# EAGLE design FTDI-Breakout_v21 (EAGLE 7.7.0)
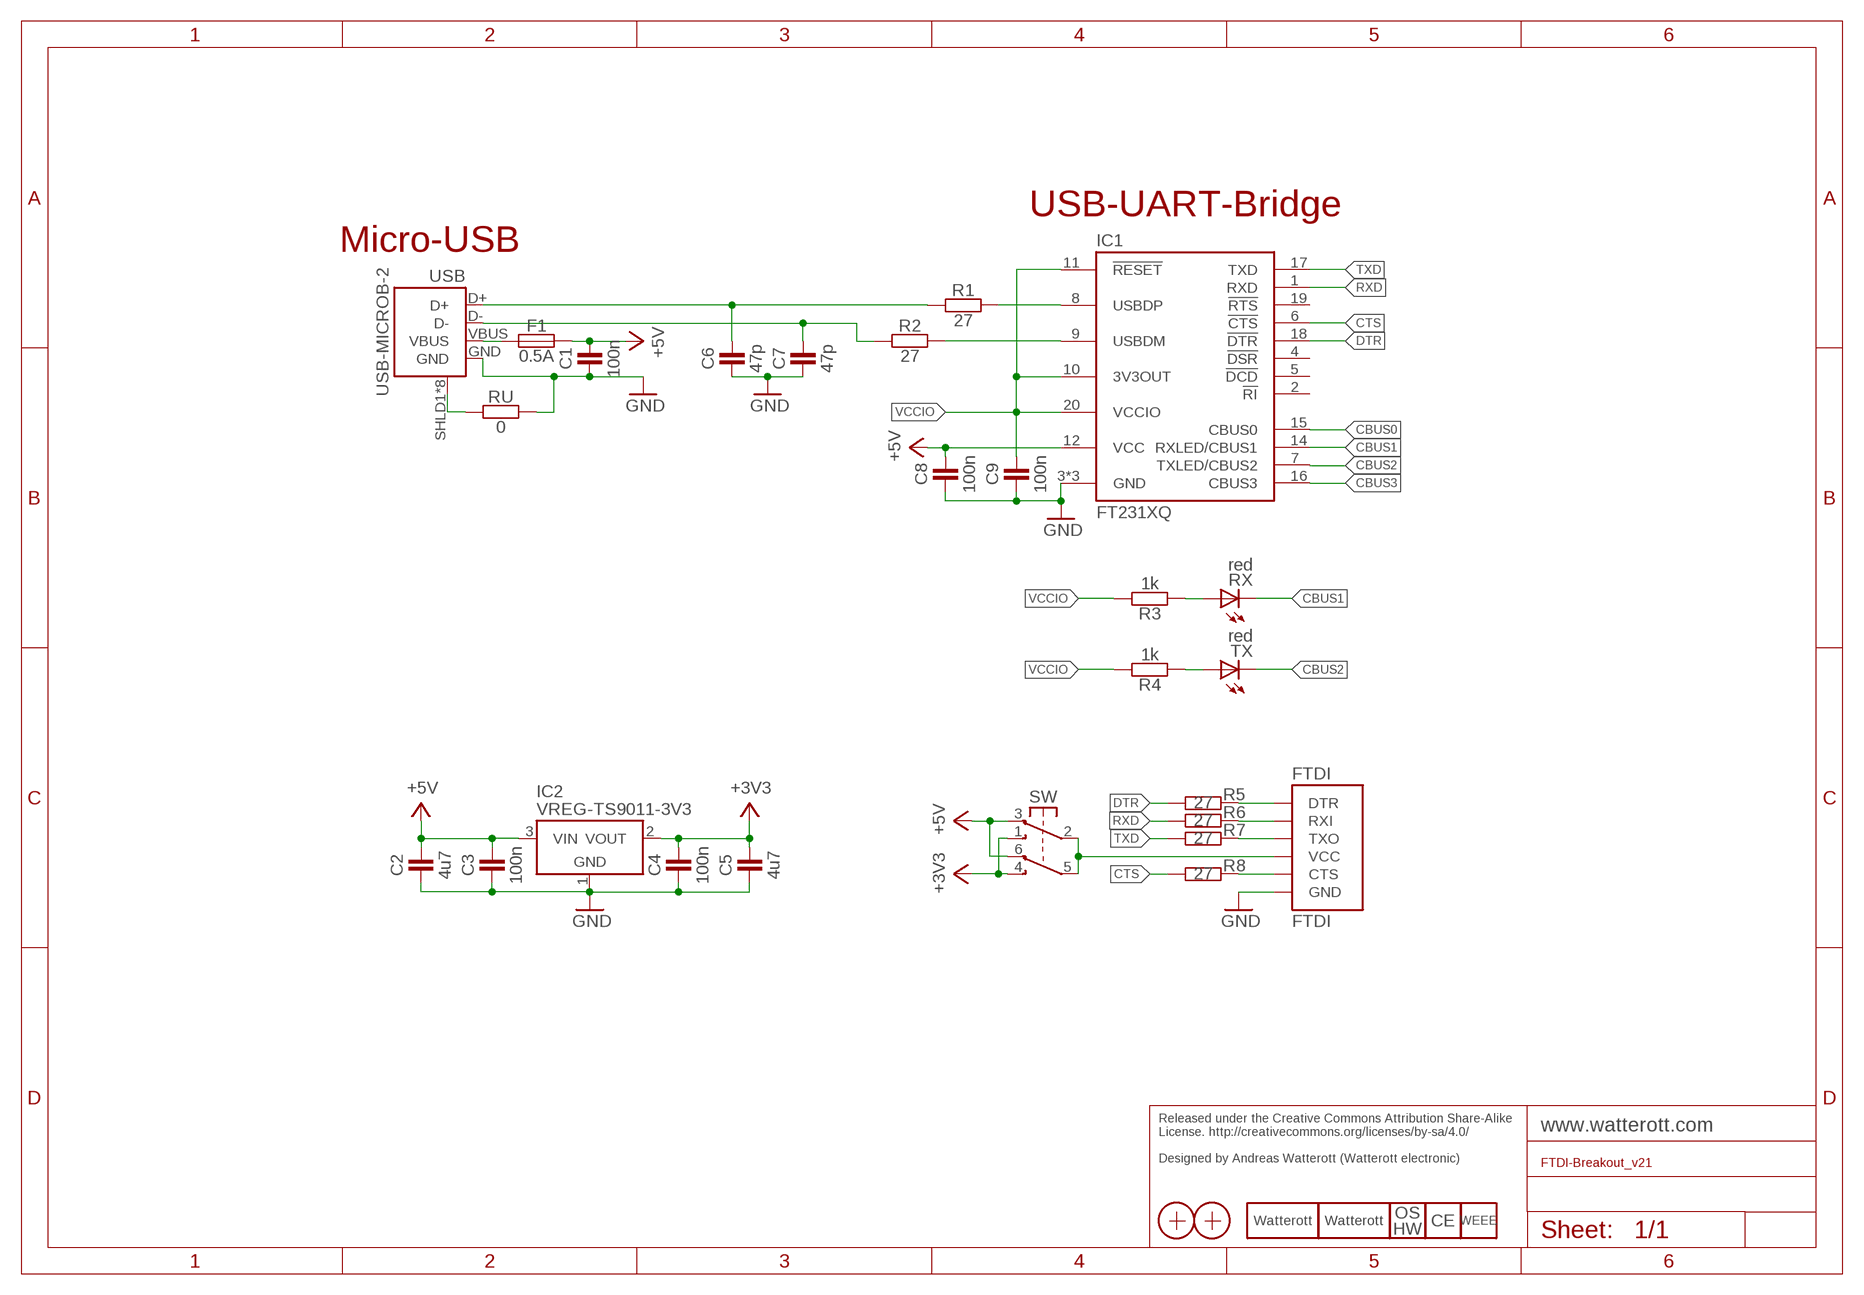
[diagram p0: schematic, sheet 1]

## Parts
C1  100n  CAPACITOR-0603  [C0603]
C2  4u7  CAPACITOR-0805  [C0805]
C3  100n  CAPACITOR-0603  [C0603]
C4  100n  CAPACITOR-0603  [C0603]
C5  4u7  CAPACITOR-0805  [C0805]
C6  47p  CAPACITOR-0603  [C0603]
C7  47p  CAPACITOR-0603  [C0603]
C8  100n  CAPACITOR-0603  [C0603]
C9  100n  CAPACITOR-0603  [C0603]
F1  0.5A  FUSE-0805  [C0805]
FTDI  FTDI  [FTDI]
IC1  FT231XQ  [QFN20-PAD]
IC2  VREG-TS9011-3V3  [SOT23]
LOGO5  LOGO_SPARK-2  [SPARK_2MM]
LOGO6  LOGO_SPARK-4  [SPARK_4MM]
LOGO7  LOGO_OSHW-2  [OSHW_2MM]
LOGO8  LOGO_CE-2  [CE_2MM]
LOGO9  LOGO_WEEE-4  [WEEE_4MM]
R1  27  RESISTOR-0603  [C0603]
R2  27  RESISTOR-0603  [C0603]
R3  1k  RESISTOR-0603  [C0603]
R4  1k  RESISTOR-0603  [C0603]
R5  27  RESISTOR-0603  [C0603]
R6  27  RESISTOR-0603  [C0603]
R7  27  RESISTOR-0603  [C0603]
R8  27  RESISTOR-0603  [C0603]
RU  0  RESISTOR-0603  [C0603]
RX  red  LED-0603  [C0603]
SW  SW-2UM-CUS22B  [CUS22B]
TX  red  LED-0603  [C0603]
USB  USB-MICROB-2  [USB-MICROB-10118194]
X1  PASSER-07  [PASSER_07MM]
X2  PASSER-07  [PASSER_07MM]

## Nets
+3V3: C4.2 C5.2 IC2.2(VOUT) SW.1(S1) SW.4(S2)
+5V: C1.2 C2.2 C3.2 C8.2 F1.2 IC1.12(VCC) IC2.3(VIN) SW.3(O1) SW.6(O2)
CBUS0: IC1.15(CBUS0)
CBUS1: IC1.14(RXLED/CBUS1) RX.C
CBUS2: IC1.7(TXLED/CBUS2) TX.C
CBUS3: IC1.16(CBUS3)
CTS: IC1.6(!CTS) R8.1
D2_N: IC1.9(USBDM) R2.2
D2_P: IC1.8(USBDP) R1.2
D_N: C7.2 R2.1 USB.D-
D_P: C6.2 R1.1 USB.D+
DTR: IC1.18(!DTR) R5.1
FTDI-CTS: FTDI.2-CTS(CTS) R8.2
FTDI-DTR: FTDI.6-DTR(DTR) R5.2
FTDI-RXI: FTDI.5-RXI(RXI) R6.2
FTDI-TXO: FTDI.4-TXO(TXO) R7.2
FTDI-VCC: FTDI.3-VCC(VCC) SW.2(P1) SW.5(P2)
GND: C1.1 C2.1 C3.1 C4.1 C5.1 C6.1 C7.1 C8.1 C9.1 FTDI.1-GND(GND) IC1.3(GND) IC1.13(GND) IC1.TP(GND) IC2.1(GND) RU.2 USB.GND
N$39: RU.1 USB.SHLD1(SHIELD) USB.SHLD2(SHIELD) USB.SHLD3(SHIELD) USB.SHLD4(SHIELD) USB.SHLD5(SHIELD) USB.SHLD6(SHIELD) USB.SHLD7(SHIELD) USB.SHLD8(SHIELD)
RX-LED: R3.1 RX.A
RXD: IC1.1(RXD) R6.1
TX-LED: R4.1 TX.A
TXD: IC1.17(TXD) R7.1
VBUS: F1.1 USB.VBUS
VCCIO: C9.2 IC1.10(3V3OUT) IC1.11(!RESET) IC1.20(VCCIO) R3.2 R4.2
Unconnected: IC1.2(!RI) IC1.4(!DSR) IC1.5(!DCD) IC1.19(!RTS)

## Notes on the sheet
- USB-UART-Bridge
- Micro-USB
- Released under the Creative Commons Attribution Share-Alike 
  License. http://creativecommons.org/licenses/by-sa/4.0/
  
  Designed by Andreas Watterott (Watterott electronic)

## Library data of the parts
C1-C9 = we-rcl:CAPACITOR: Capacitors ...2.2uF @ 6.3V -> 0402 ...4.7uF @ 6.3V -> 0603 ...10uF @ 16V -> 0805 ...22uF @ 25V -> 1206
F1 = we-rcl:FUSE: Fuses Polyfuses 0805 - 0.5A or 1A, 6V 1206 - 2A, 6V 1812 - 1A or 2A, 16V
FTDI = we-board:FTDI: FTDI 6pol connector
IC1 = we-chip:FT231X: FTDI FT231X USB to UART Bridge (5V tolerant inputs); DIGIKEY: 768-1128-6-ND
IC2 = we-power:VREG: Voltage Regulators (LDOs, Switching Converters...) LDOs Taiwan Semi TS1117 800mA max 15V - compatible On Semi NCP1117 1A max 20V - compatible Diodes AP2111H 0.6A max 6V (0.25V@0.6A) - compatible Diodes AP2114H 1A max 6V (0.45V@1A) Taiwan Semi TS9011 250mA max 12V - compatible Diodes AP2210 300mA max 15V - compatible Microchip MCP1700 250mA max 6.5V - compatible Microchip MCP1702 250mA max 13V - compatible Microchip MCP1703 250mA max 16V - compatible Microchip MCP1754 150mA max 16V Taiwan Semi TS5204 150mA max 16V (low noise) DC/DC Converter Modules Recom R-78Ex.x-1.0-W36 1A max 28V - compatible CUI V78xx-2000 2A max 18V Murata OKI-78SR-x.x/1.5-W36 1.5A max 36V
LOGO5 LOGO6 = we-symbol:LOGO_SPARK: Watterott electronic Logo
LOGO7 = we-symbol:LOGO_OSHW: Open-Source-Hardware Logo
LOGO8 = we-symbol:LOGO_CE: CE Logo
LOGO9 = we-symbol:LOGO_WEEE: WEEE Logo
R1-R8 RU = we-rcl:RESISTOR: Resistors all kinds in 0402 and 0603
RX TX = we-opto:LED: LEDs red, green, blue -> 0603
SW = we-switch:SW-2UM: Switch; DIGIKEY: 563-1105-6-ND
USB = we-con:USB: USB Connectors; DIGIKEY: 609-4618-6-ND
X1 X2 = we-symbol:PASSER: Fiducial Markers

## Board
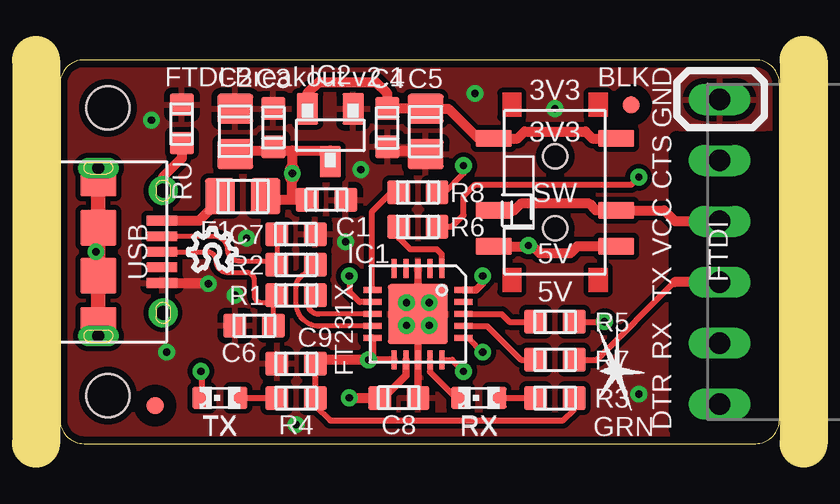
[diagram p1: board, top side]
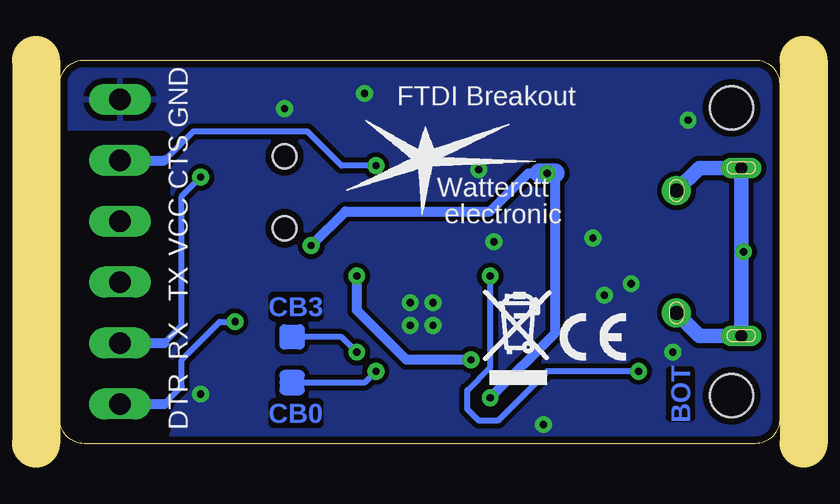
[diagram p2: board, bottom side, seen from below]

Size 30 x 16 mm. Coordinates in mm from the lower left corner, seen from the top.
Outline: 0,1 arc90 1,0 29,0 arc90 30,1 30,15 arc90 29,16 1,16 arc90 0,15 0,1
Copper layers (1*16): Top 0.035mm / dielectric 1.5mm / Bottom 0.035mm
Design rules "we-dru-2-layer *": minimum track width 0.15mm, minimum drill 0.3mm, track to track 0.15mm, track to pad 0.15mm, pad to pad 0.15mm, via to via 0.15mm, smd to smd 0.1mm, copper to edge 0.3mm, drill to drill 0.2mm, minimum pad ring 0.18mm, minimum via ring 0.2mm, stop-mask expansion 0.1mm, vias tented up to drill 0.5mm, thermal gap 0.25mm
Holes 1.8 mm at 2,2 2,14
tRestrict: area 25.7,0.6 to 29.5,12.7
bRestrict: area 25.7,0.6 to 29.5,12.7
Milling: 2 lines

### Footprints (pad centres in the part's own frame; a part is rotated, then mirrored left to right if it is on the bottom)
C0603 = smd 1 x 0.95: 1 0,0.8; 2 0,-0.8
C0805 = smd 1.5 x 1.25: 1 0,0.95; 2 0,-0.95
FTDI = drill 0.9 pad 1.3 long: 1-GND 0,6.35; 2-CTS 0,3.81; 3-VCC 0,1.27; 4-TXO 0,-1.27; 5-RXI 0,-3.81; 6-DTR 0,-6.35
QFN20-PAD = smd 0.8 x 0.26: 1 -1.9,1; 2 -1.9,0.5; 3 -1.9,0; 4 -1.9,-0.5; 5 -1.9,-1; 11 1.9,-1; 12 1.9,-0.5; 13 1.9,0; 14 1.9,0.5; 15 1.9,1 | smd 0.26 x 0.8: 6 -1,-1.9; 7 -0.5,-1.9; 8 0,-1.9; 9 0.5,-1.9; 10 1,-1.9; 16 1,1.9; 17 0.5,1.9; 18 0,1.9; 19 -0.5,1.9; 20 -1,1.9 | smd 2.5 x 2.5: TP 0,0
SOT23 = smd 1.3 x 0.9: 1 -1.1,0.95; 2 -1.1,-0.95; 3 1.1,0
C0603' = smd 0.9 x 0.8: A 0,-0.75; C 0,0.75
CUS22B = smd 0.7 x 1.5: 1 -2.25,2.55; 2 0.75,2.55; 3 2.25,2.55; 4 -2.25,-2.55; 5 0.75,-2.55; 6 2.25,-2.55 | hole 1: -1.5,0; 1.5,0
USB-MICROB-10118194 = smd 1.3 x 0.4: D+ -2.5,0; D- -2.5,-0.65; GND -2.5,1.3; ID -2.5,0.65; VBUS -2.5,-1.3 | drill 0.6 pad 1.2: SHLD1 -2.55,2.55; SHLD2 -2.55,-2.55 | drill 0.5 pad 0.8 long: SHLD3 0.15,3.5; SHLD4 0.15,-3.5 | smd 1.5 x 1.1: SHLD5 0.15,2.85; SHLD6 0.15,-2.85 | smd 1.5 x 1.5: SHLD7 0.15,1; SHLD8 0.15,-1
PASSER_07MM = smd 0.7 x 0.7: X 0,0

### Placement (x,y rotation side)
C1  11.11,10.16 270 top
C2  7.3,13.02 0 top
C3  8.89,13.18 0 top
C4  13.65,13.18 180 top
C5  15.24,13.02 180 top
C6  8.1,4.92 90 top
C7  9.84,8.73 270 top
C8  14.13,1.91 270 top
C9  9.84,3.33 90 top
F1  7.62,10.32 90 top
FTDI  27.5,8 0 top
IC1  14.92,5.4 270 top
IC2  11.27,12.86 270 top
LOGO5  23.18,3.02 90 top
LOGO6  14.76,11.91 0 bottom
LOGO7  6.35,8.1 0 top
LOGO8  7.78,4.45 0 bottom
LOGO9  10.95,4.45 0 bottom
R1  9.84,6.19 90 top
R2  9.84,7.46 90 top
R3  20.64,1.91 90 top
R4  9.84,1.91 90 top
R5  20.64,5.08 90 top
R6  14.92,9.05 90 top
R7  20.64,3.49 90 top
R8  14.92,10.48 90 top
RU  5.08,13.34 180 top
RX  red  [C0603']  17.46,1.91 90 top
SW  20.64,10.48 270 top
TX  red  [C0603']  6.67,1.91 90 top
USB  1.75,8 180 top
X1  3.97,1.59 0 top
X2  23.81,14.13 0 top

### Tracks (layer width: path | path; a pad name or v marks a point on that pad's centre or on a via)
+3V3
  Top 0.254: 18.06,12.7 SW.4
  Top 0.406: SW.4 19.08,12.73 19.37,13.02 21.91,13.02 22.2,12.73 SW.1 | 18.06,12.7 17.46,12.7 16.2,13.97 C5.2 13.65,13.97 C4.2 13.65,14.61 13.18,15.08 10.79,15.08 10.32,14.61 IC2.2
+5V  (via drill 0.3)
  Top 0.254: 8.89,12.07 8.89,12.06 8.89,12.22
  Top 0.305: IC1.12 14.42,2.83 13.49,1.91 C8.2
  Top 0.406: v12.06,1.91 C8.2 | SW.3 21.56,8.23 21.27,7.94 20,7.94 19.71,8.23 19.53,8.23 | C2.2 7.3,12.22 8.89,12.22 | C1.2 9.68,10.16 | 9.68,10.16 9.68,11.11 | 8.89,12.22 9.68,12.22 | 9.68,12.22 9.68,11.43 | 9.68,10.16 8.73,10.16 F1.2 | SW.6 19.53,8.23 | v19.53,8.26 19.53,8.23 | 9.68,12.22 11.27,12.22 IC2.3 | 8.89,12.22 C3.2
  Top 0.61: 9.68,11.11 v9.68,11.27 9.68,11.43
  Top 0.813: C2.2 7.3,11.91
  Bottom 0.406: 10,11.27 10.48,11.27 12.06,9.68 18.1,9.68 v19.53,8.26 | 9.37,11.27 9.37,4.6 v12.06,1.91
  Bottom 0.813: 9.37,11.27 v9.68,11.27 10,11.27
CBUS0  (via drill 0.3)
  Top 0.254: IC1.15 16.35,3.5 v16.83,3.02
  Bottom 0.254: v16.83,3.02 17.3,2.54 20,2.54
  Bottom 0.406: 20.64,2.54 20.64,2.86 20,2.86 20,2.54 | 20.64,2.54 20.64,2.22 20,2.22 20,2.54 | 20,2.54 20.64,2.54
CBUS1
  Top 0.254: IC1.14 15.42,2.99 16.51,1.91 RX.C
CBUS2  (via drill 0.3)
  Top 0.254: IC1.7 12.5,5.9 12.06,6.33 v12.06,6.99 | TX.C 5.92,2.97 v5.87,3.02
  Bottom 0.254: v12.06,6.99 12.06,3.17 13.02,2.22 13.02,1.43 12.54,0.95 11.75,0.95 9.68,3.02 v5.87,3.02
CBUS3  (via drill 0.3)
  Top 0.254: IC1.16 17.03,4.4 v17.62,3.81
  Bottom 0.254: v17.62,3.81 18.26,4.45 20.64,4.45
  Bottom 0.406: 20,4.76 20,4.13 20.64,4.13 20.64,4.45 20.64,4.76 20,4.76
CTS
  Top 0.254: IC1.6 13.02,6.5 13.02,6.51 13.02,9.68 13.81,10.48 R8.1
D2_N
  Top 0.203: IC1.9 10.82,4.9 arc-90 9.84,5.87 9.84,6.51 arc-90 10.48,7.14 10.69,7.36 10.69,7.41 R2.2
D2_P
  Top 0.203: IC1.8 10.79,5.4 arc-90 10.32,5.87 10.32,6.19 R1.2
D_N
  Top 0.15: 8.86,7.59 8.91,7.59
  Top 0.203: USB.D- 6.43,8.65 arc-90 6.99,8.1 arc90 7.46,7.62 8.83,7.62 8.86,7.59 | C7.2 R2.1 8.91,7.59
D_P
  Top 0.15: 8.9,5.88 8.89,5.87
  Top 0.203: USB.D+ 6.13,8 arc-90 6.51,7.62 arc90 6.99,7.14 7.78,7.14 arc-90 8.1,6.83 8.1,6.19 arc90 8.41,5.87 8.89,5.87 8.95,5.82 | C6.2 8.9,5.88 8.9,6.04 R1.1
DTR
  Top 0.254: IC1.18 18.41,5.4 18.73,5.08 R5.1
FTDI-CTS  (via drill 0.3)
  Top 0.254: R8.2 16.03,10.48 16.83,11.27 v16.83,11.59
  Bottom 0.254: v16.83,11.59 18.26,11.59 19.68,13.02 24.45,13.02 25.66,11.81
  Bottom 0.406: FTDI.2-CTS 25.66,11.81
FTDI-DTR  (via drill 0.3)
  Top 0.254: R5.2 v22.7,5.08
  Bottom 0.254: 25.66,1.65 24.92,2.38 24.92,3.49 23.34,5.08 v22.7,5.08
  Bottom 0.406: FTDI.6-DTR 25.66,1.65
FTDI-RXI  (via drill 0.3)
  Top 0.254: R6.2 16.35,9.05 16.83,9.53 16.83,10.32 17.3,10.79 23.81,10.79 v24.13,11.11
  Bottom 0.254: 25.66,4.19 24.92,4.92 24.92,10.32 v24.13,11.11
  Bottom 0.406: FTDI.5-RXI 25.66,4.19
FTDI-TXO
  Top 0.254: R7.2 22.38,3.49 25.62,6.73
  Top 0.406: FTDI.4-TXO 25.62,6.73
FTDI-VCC
  Top 0.406: SW.5 18.93,9.73 19.21,10 22.07,10 22.34,9.73 SW.2 25.2,9.73 25.66,9.27 FTDI.3-VCC
GND  (via drill 0.3)
  Top 0.254: 14.92,4.92 IC1.TP | v14.45,4.92 14.92,4.92 | v15.4,4.92 14.92,4.92 | v14.45,5.87 14.92,5.87 v15.4,5.87
  Top 0.305: IC1.13 14.92,4.92 | IC1.3 14.92,5.87 IC1.TP | IC1.13 C8.1
  Top 0.406: C4.1 13.65,12.22 15.08,12.22 C5.1 | USB.GND 6.19,6.7 v6.19,6.67
  other vias: 3.81,13.49 12.54,11.43 7.3,6.19 11.91,8.41 7.78,8.57 20.64,13.97 24.13,2.06 17.3,14.61 9.84,0.79 4.45,3.81
  pour Top (isolate 0.203, rank 2): 0,16 30,16 30,0 0,0
  pour Bottom (isolate 0.203): 0,16 30,16 30,0 0,0
N$39  (via drill 0.3)
  Top 0.406: RU.1 5.08,11.91 4.29,11.11 4.29,10.56 USB.SHLD2
  Top 0.61: USB.SHLD4 USB.SHLD6 USB.SHLD8 USB.SHLD7 USB.SHLD5 1.6,4.46 1.59,4.45
  Bottom 0.61: 1.6,8.1 USB.SHLD3 3.35,4.5 USB.SHLD1 | 1.6,8.1 USB.SHLD4 3.35,11.5 USB.SHLD2 | v1.5,8 1.6,8.1
RX-LED
  Top 0.254: RX.A R3.1
RXD
  Top 0.254: IC1.1 15.92,7.89 15.72,8.1 14.61,8.1 14.13,8.57 14.13,8.99 14.12,9 R6.1
TX-LED
  Top 0.254: TX.A R4.1
TXD
  Top 0.254: IC1.17 17.8,4.9 19.21,3.49 R7.1
VBUS
  Top 0.406: USB.VBUS 5.81,9.3 6.67,10.16 F1.1
VCCIO  (via drill 0.3)
  Top 0.254: C9.2 R4.2 10.64,1.58 11.27,0.95 20.95,0.95 21.44,1.44 R3.2 | 10.7,3.5 10.69,3.49
  Top 0.305: IC1.11 13.02,3.5 13.02,3.65 | IC1.10 13.02,3.65 | v12.86,3.49 13.02,3.65 | IC1.20 17.35,6.4 17.62,6.67 v17.62,6.99
  Top 0.406: 13.02,3.5 10.7,3.5 | v12.86,3.49 | C9.2 10.64,3.44 10.69,3.49
  Bottom 0.406: v12.86,3.49 15.56,3.49 17.62,5.56 v17.62,6.99

### Text on the board
Bottom: CB3 | BOT | CB0
tPlace: FTDI-Breakout v2.1 | BLK | 3V3 | GND | 3V3 | CTS | VCC | 5V | 7mm Spacing | TX | 5V | FT231X | RX | DTR | TX | RX | GRN
bPlace: FTDI Breakout | GND | CTS | Watterott | electronic | VCC | TX | RX | DTR
Reference: Silkscreen: 21 tPlace + 22 bPlace